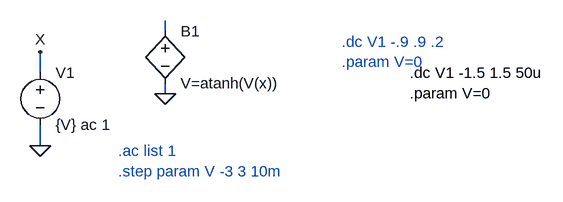
[diagram p0: schematic Draft2.asc]
Draft2.asc, the LTspice schematic file:
Version 4
SHEET 1 1148 680
WIRE 432 80 432 64
WIRE 240 144 240 112
WIRE 432 176 432 160
WIRE 240 256 240 224
FLAG 240 256 0
FLAG 240 112 X
FLAG 432 176 0
SYMBOL voltage 240 128 R0
SYMATTR InstName V1
SYMATTR Value {V} ac 1
SYMBOL bv 432 64 R0
SYMATTR InstName B1
SYMATTR Value V=atanh(V(x))
TEXT 360 264 Left 2 ;.ac list 1\n.step param V -3 3 10m
TEXT 808 144 Left 2 !.dc V1 -1.5 1.5 50u\n.param V=0
TEXT 704 96 Left 2 ;.dc V1 -.9 .9 .2\n.param V=0

The netlist it stands for:
* Draft2.asc
V1 X 0 {V} ac 1
B1 N001 0 V=atanh(V(x))
* .ac list 1
* .step param V -3 3 10m
.dc V1 -1.5 1.5 50u
.param V=0
* .dc V1 -.9 .9 .2
* .param V=0
.backanno
.end